# Altium schematic sheet PowerConnector.SchDoc
size A4; SheetNumber: 12; SheetTotal: 15
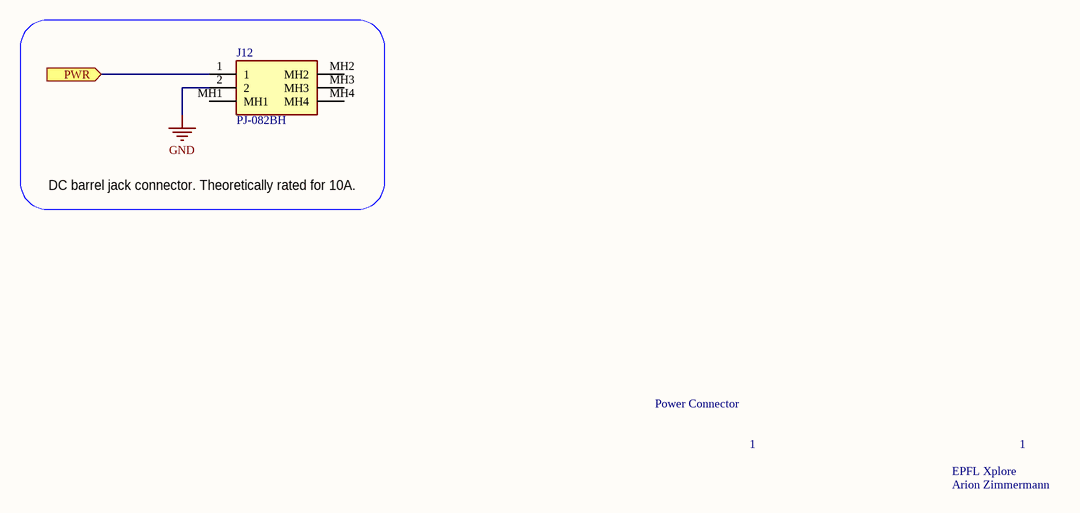
[diagram p0: PowerConnector.SchDoc]

## Parts
J12  PJ-082BH  [PJ082BH]

## Ports
PWR (in)

## Nets
GND: J12.2
PWR: J12.1 ; port PWR

Not connected (* = marked no-connect by the designer): J12 MH1 MH2 MH3 MH4

## Notes on the sheet
- DC barrel jack connector. Theoretically rated for 10A.
- Power Connector
- 1
- EPFL Xplore
- Arion Zimmermann

## Library data of the parts
J12 = PJ-082BH: Connector; Manufacturer_Name: CUI Inc.; Datasheet Link: https://www.mouser.co.uk/datasheet/2/670/pj_082bh-1779031.pdf; Height: 10.2mm; Manufacturer_Part_Number: PJ-082BH; Mouser Part Number: 490-PJ-082BH; Mouser Price/Stock: https://www.mouser.co.uk/ProductDetail/CUI-Devices/PJ-082BH?qs=WyjlAZoYn52P2Lo8hPB1tg%3D%3D; Arrow Part Number: PJ-082BH; Arrow Price/Stock: https://www.arrow.com/en/products/pj-082bh/cui-devices?region=nac; Supplier 1: Mouser; Supplier Part Number 1: 490-PJ-082BH